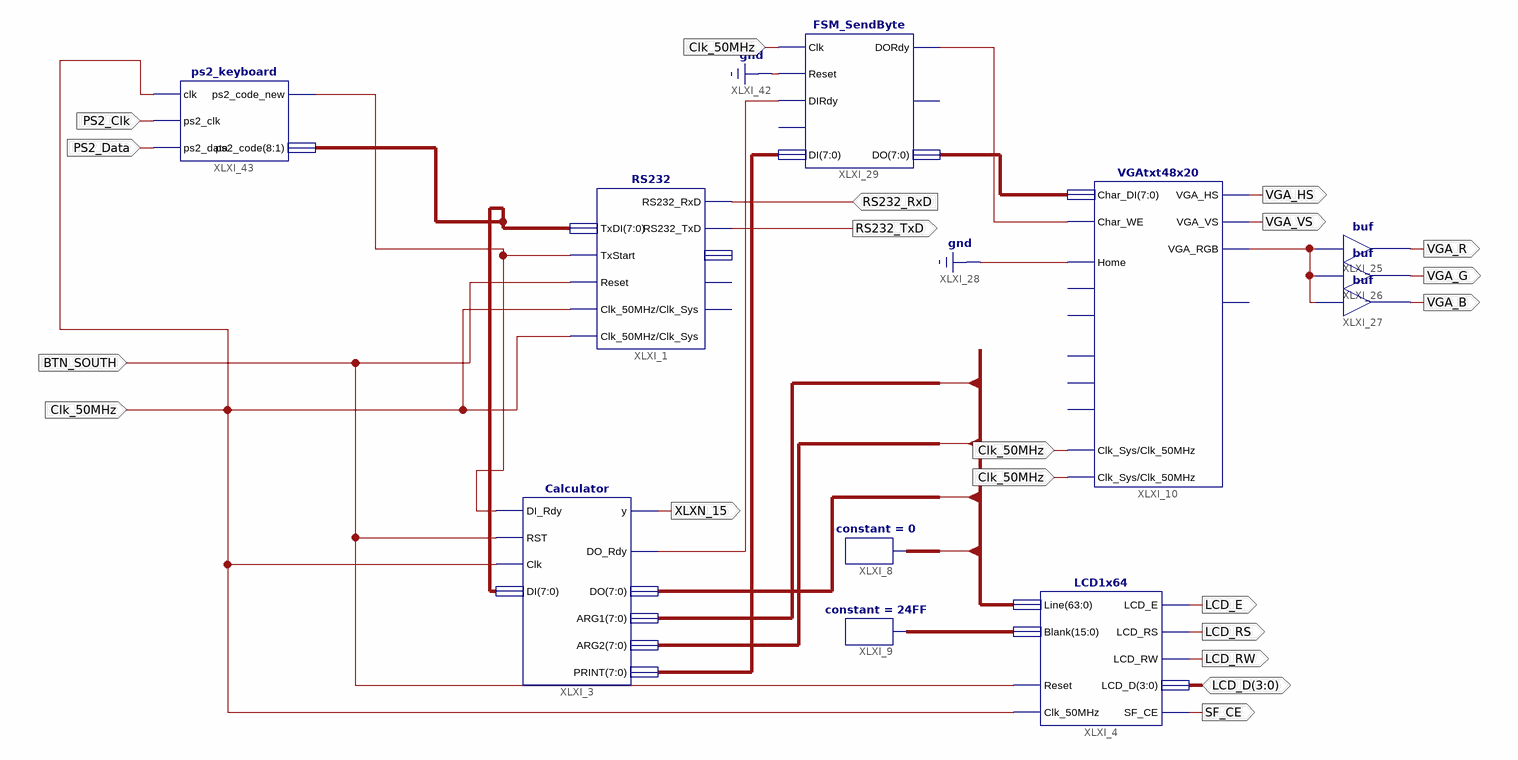
[diagram p0: schematic sheet 1]
// Xilinx ISE schematic hardware_test.sch (spartan3e) as structural Verilog: 11 symbols, 17 ports
module hardware_test (
  input  RS232_RxD,
  input  PS2_Data,
  input  BTN_SOUTH,
  input  Clk_50MHz,
  input  PS2_Clk,
  inout  [3:0] LCD_D,
  output RS232_TxD,
  output XLXN_15,
  output SF_CE,
  output LCD_RW,
  output LCD_RS,
  output LCD_E,
  output VGA_R,
  output VGA_G,
  output VGA_B,
  output VGA_HS,
  output VGA_VS
);

  wire XLXN_105, XLXN_144, XLXN_159, XLXN_166;
  wire [7:0] XLXN_3, XLXN_147, XLXN_155;
  wire [15:0] XLXN_40;
  wire [63:0] aaa;

  RS232 XLXI_1 (
    .Clk_50MHz(Clk_50MHz), .Reset(BTN_SOUTH), .RS232_RxD(RS232_RxD), .TxStart(XLXN_166), .TxDI(XLXN_3),
    .RS232_TxD(RS232_TxD), .Clk_Sys(Clk_50MHz));  // open: TxBusy, RxRdy, RxDO
  Calculator XLXI_3 (
    .DI_Rdy(XLXN_166), .RST(BTN_SOUTH), .Clk(Clk_50MHz), .DI(XLXN_3), .y(XLXN_15), .DO_Rdy(XLXN_159),
    .ARG1(aaa[63:56]), .ARG2(aaa[51:44]), .DO(aaa[39:32]), .PRINT(XLXN_155));
  LCD1x64 XLXI_4 (
    .Clk_50MHz(Clk_50MHz), .Reset(BTN_SOUTH), .Line(aaa), .Blank(XLXN_40), .LCD_D(LCD_D), .LCD_E(LCD_E),
    .LCD_RW(LCD_RW), .LCD_RS(LCD_RS), .SF_CE(SF_CE));
  constant #(.CValue("0")) XLXI_8 (.O(aaa[31:0]));
  constant #(.CValue("24FF")) XLXI_9 (.O(XLXN_40));
  VGAtxt48x20 XLXI_10 (
    .Char_DI(XLXN_147), .Home(1'b0), .Clk_Sys(Clk_50MHz), .Clk_50MHz(Clk_50MHz), .VGA_HS(VGA_HS),
    .VGA_VS(VGA_VS), .VGA_RGB(XLXN_105), .Char_WE(XLXN_144));  // open: NewLine, Goto00, CursorOn, ScrollEn, ScrollClear, Busy
  buf XLXI_25 (VGA_R, XLXN_105);
  buf XLXI_26 (VGA_G, XLXN_105);
  buf XLXI_27 (VGA_B, XLXN_105);
  FSM_SendByte XLXI_29 (
    .Clk(Clk_50MHz), .Reset(1'b0), .DIRdy(XLXN_159), .DI(XLXN_155), .DORdy(XLXN_144), .DO(XLXN_147));  // open: TxBusy, Busy
  ps2_keyboard XLXI_43 (
    .clk(Clk_50MHz), .ps2_clk(PS2_Clk), .ps2_data(PS2_Data), .ps2_code_new(XLXN_166), .ps2_code(XLXN_3));
endmodule
